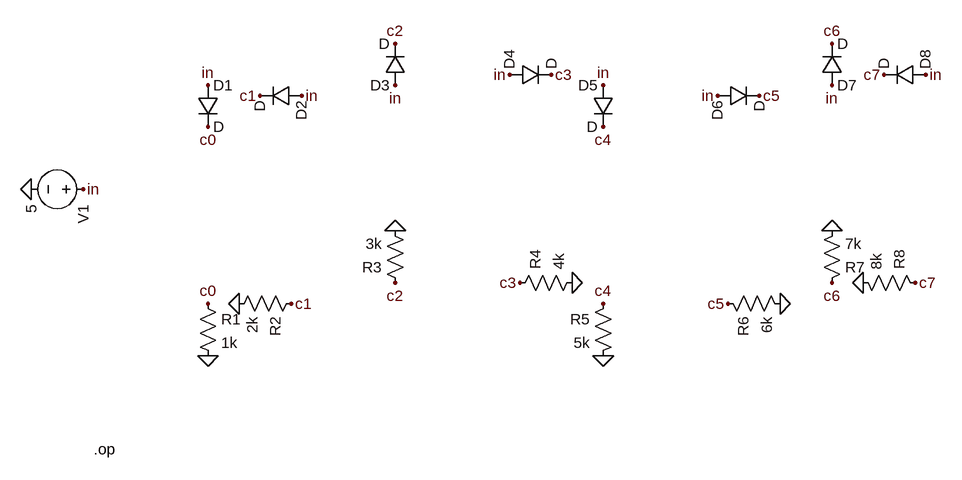
[diagram p0: schematic orientations.asc]
orientations.asc, the LTspice schematic file:
Version 4
SHEET 1 1600 1000
FLAG -176 160 in
FLAG -256 160 0
FLAG 16 0 in
FLAG 16 64 c0
FLAG 16 336 c0
FLAG 16 416 0
FLAG 160 16 in
FLAG 96 16 c1
FLAG 144 336 c1
FLAG 64 336 0
FLAG 304 0 in
FLAG 304 -64 c2
FLAG 304 304 c2
FLAG 304 224 0
FLAG 480 -16 in
FLAG 544 -16 c3
FLAG 496 304 c3
FLAG 576 304 0
FLAG 624 0 in
FLAG 624 64 c4
FLAG 624 336 c4
FLAG 624 416 0
FLAG 800 16 in
FLAG 864 16 c5
FLAG 816 336 c5
FLAG 896 336 0
FLAG 976 0 in
FLAG 976 -64 c6
FLAG 976 304 c6
FLAG 976 224 0
FLAG 1120 -16 in
FLAG 1056 -16 c7
FLAG 1104 304 c7
FLAG 1024 304 0
SYMBOL voltage -160 160 R90
SYMATTR InstName V1
SYMATTR Value 5
SYMBOL diode 0 0 R0
SYMATTR InstName D1
SYMATTR Value D
SYMBOL res 0 320 R0
SYMATTR InstName R1
SYMATTR Value 1k
SYMBOL diode 160 0 R90
SYMATTR InstName D2
SYMATTR Value D
SYMBOL res 160 320 R90
SYMATTR InstName R2
SYMATTR Value 2k
SYMBOL diode 320 0 R180
SYMATTR InstName D3
SYMATTR Value D
SYMBOL res 320 320 R180
SYMATTR InstName R3
SYMATTR Value 3k
SYMBOL diode 480 0 R270
SYMATTR InstName D4
SYMATTR Value D
SYMBOL res 480 320 R270
SYMATTR InstName R4
SYMATTR Value 4k
SYMBOL diode 640 0 M0
SYMATTR InstName D5
SYMATTR Value D
SYMBOL res 640 320 M0
SYMATTR InstName R5
SYMATTR Value 5k
SYMBOL diode 800 0 M90
SYMATTR InstName D6
SYMATTR Value D
SYMBOL res 800 320 M90
SYMATTR InstName R6
SYMATTR Value 6k
SYMBOL diode 960 0 M180
SYMATTR InstName D7
SYMATTR Value D
SYMBOL res 960 320 M180
SYMATTR InstName R7
SYMATTR Value 7k
SYMBOL diode 1120 0 M270
SYMATTR InstName D8
SYMATTR Value D
SYMBOL res 1120 320 M270
SYMATTR InstName R8
SYMATTR Value 8k
TEXT -160 560 Left 2 !.op

The netlist it stands for:
* orientations.asc
V1 in 0 5
D1 in c0 D
R1 c0 0 1k
D2 in c1 D
R2 c1 0 2k
D3 in c2 D
R3 c2 0 3k
D4 in c3 D
R4 c3 0 4k
D5 in c4 D
R5 c4 0 5k
D6 in c5 D
R6 c5 0 6k
D7 in c6 D
R7 c6 0 7k
D8 in c7 D
R8 c7 0 8k
.model D D
.lib standard.dio
.op
.backanno
.end